# EAGLE schematic sleepmask (EAGLE 8.5.0)
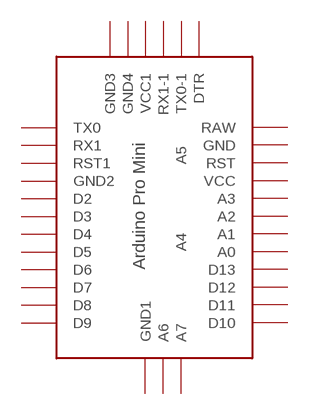
[diagram p0: schematic, sheet 1]

## Parts
U$1  ABK-PRO-MINI  [ABK-PRO-MINI]
Unconnected: U$1.A0 U$1.A1 U$1.A2 U$1.A3 U$1.A4 U$1.A5 U$1.A6 U$1.A7 U$1.D2 U$1.D3 U$1.D4 U$1.D5 U$1.D6 U$1.D7 U$1.D8 U$1.D9 U$1.D10 U$1.D11 U$1.D12 U$1.D13 U$1.DTR U$1.GND U$1.GND1(GND2) U$1.GND2(GND3) U$1.GND3(GND4) U$1.GND4(GND1) U$1.RAW U$1.RST U$1.RST1 U$1.RX1 U$1.RX1-1 U$1.TX0 U$1.TX0-1 U$1.VCC U$1.VCC1

## Library data of the parts
U$1 = Arduino-clone:ABK-PRO-MINI: ABK Pro-Mini Arduino Clone